# EasyEDA Pro project ProPrj_小中心板_2025-08-09.epro, board PCB2
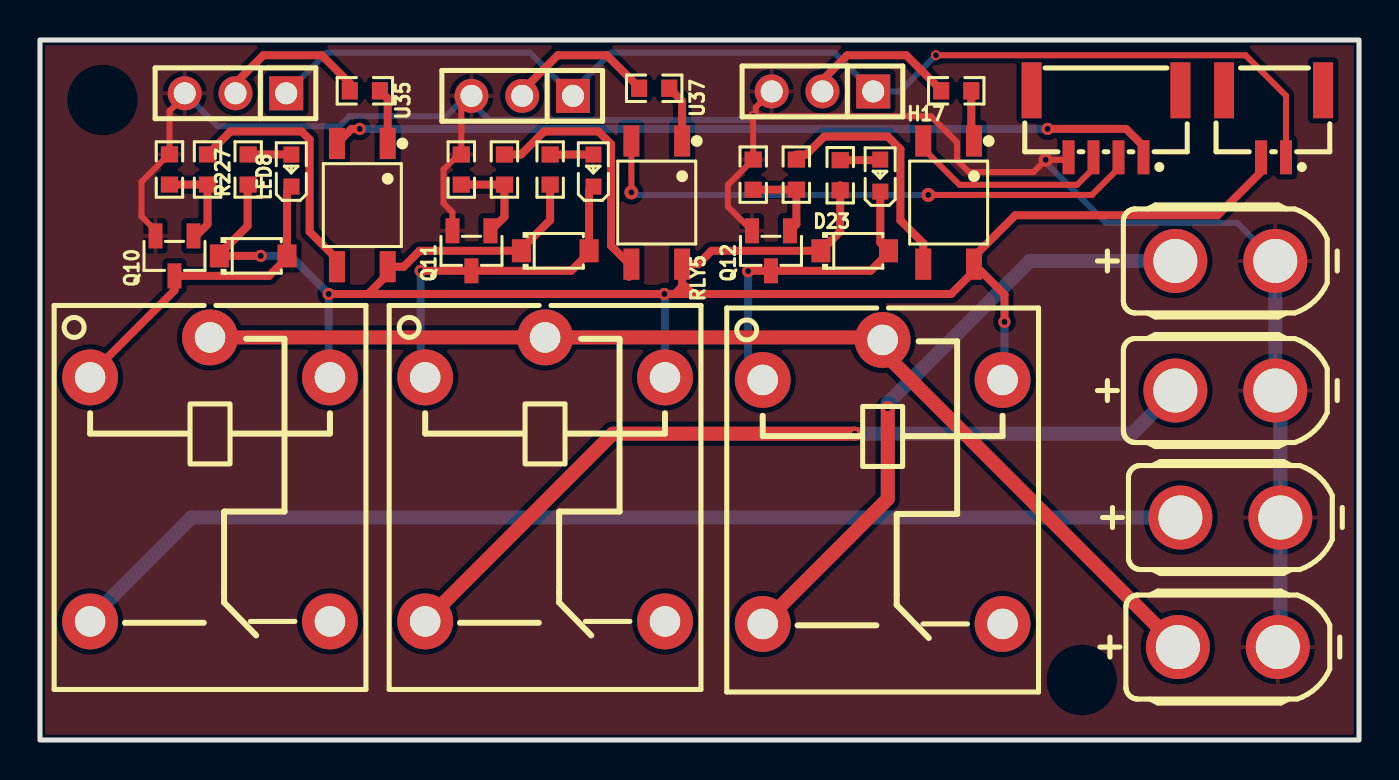
[diagram p6: board, top side]
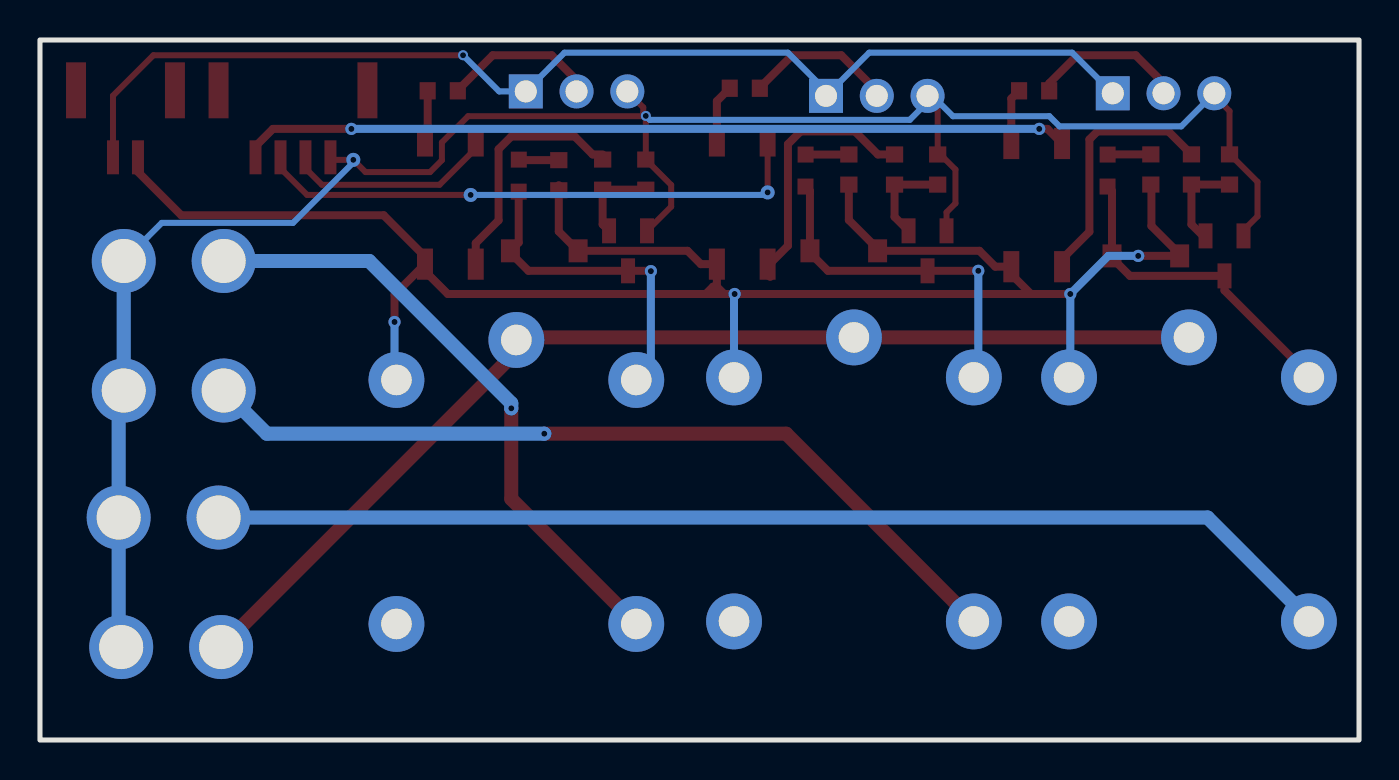
[diagram p7: board, bottom side, seen from below]

Outline 66 x 35 mm; copper layers: Top Layer, Bottom Layer. Coordinates in mm from the lower left corner of the outline.
Outline path: rectangle 0,35 66,0
Stack: Top Layer 0.035mm / Dielectric1 1.51mm FR4 er 4.5 / Bottom Layer 0.035mm

## Design rules (mm)
template: JLCPCB Capability(Two Layers Board)
spacing copperThickness1oz (default): track to track 0.102, other pairs 0.152 to 0.3
spacing copperThickness2oz: track to track 0.203, other pairs 0.152 to 0.3
track width copperThickness1oz (default): min 0.127, default 0.254, max 2.54
track width copperThickness2oz: min 0.203, default 0.254, max 2.54
differential pair differentialPair (default): width min 0.127, default 0.254, max 2.54; gap min 0.152, default 0.152
via viaSize (default): diameter min 0.5, default 0.61, max 10; hole min 0.3, default 0.305, max 6.3

## Placement (name value [footprint] x y rotation side)
CN22  WAFER-GH1.25-2PLB  [CONN-TH_2P-P1.25_XUNPU_WAFER-GH1.25-2PLB]  61.72 30.81 180 top
D22  1N4148W  [SOD-123_L2.8-W1.8-LS3.7-RD-1]  25.78 24.46 0 top
D23  1N4148W  [SOD-123_L2.8-W1.8-LS3.7-RD-1]  40.77 24.46 0 top
D24  1N4148W  [SOD-123_L2.8-W1.8-LS3.7-RD-1]  10.67 24.2 0 top
H15  PZ254V-11-03P  [HDR-TH_3P-P2.54-V-M]  9.78 32.34 180 top
H16  PZ254V-11-03P  [HDR-TH_3P-P2.54-V-M]  24.13 32.21 180 top
H17  PZ254V-11-03P  [HDR-TH_3P-P2.54-V-M]  39.15 32.43 180 top
J1  XT30UPB-F30.G.Y  [CONN-TH_XT30UPB-F]  59.56 11.12 0 top
J2  XT30UPB-F30.G.Y  [CONN-TH_XT30UPB-F]  59.31 17.47 0 top
J3  XT30UPB-F30.G.Y  [CONN-TH_XT30UPB-F]  59.31 23.95 0 top
J4  XT30UPB-F30.G.Y  [CONN-TH_XT30UPB-F]  59.44 4.65 0 top
LED8  -  [LED_0603]  12.57 28.52 90 top
LED9  -  [LED_0603]  27.69 28.52 90 top
LED10  -  [LED_0603]  42.04 28.27 90 top
Q10  S8050  [SOT-23-3_L2.9-W1.3-P1.90-LS2.4-BR]  6.73 24.2 90 top
Q11  S8050  [SOT-23-3_L2.9-W1.3-P1.90-LS2.4-BR]  21.59 24.46 90 top
Q12  S8050  [SOT-23-3_L2.9-W1.3-P1.90-LS2.4-BR]  36.58 24.46 90 top
R217  4.7K  [R0603]  23.24 28.52 90 top
R218  10K  [R0603]  21.08 28.52 90 top
R219  1K  [R0603]  25.53 28.52 90 top
R220  470Ω  [R0603]  45.85 32.46 180 top
R221  4.7K  [R0603]  37.85 28.27 90 top
R222  10K  [R0603]  35.69 28.27 90 top
R223  1K  [R0603]  40.04 28.24 90 top
R224  470Ω  [R0603]  16.26 32.46 180 top
R225  4.7K  [R0603]  8.39 28.53 90 top
R226  10K  [R0603]  6.48 28.53 90 top
R227  1K  [R0603]  10.42 28.53 90 top
R228  470Ω  [R0603]  30.73 32.59 180 top
RLY4  SRD-05VDC-SL-C  [RELAY-TH_SRD-XXVDC-XL-C]  8.51 13.03 270 top
RLY5  SRD-05VDC-SL-C  [RELAY-TH_SRD-XXVDC-XL-C]  25.27 13.03 270 top
RLY6  SRD-05VDC-SL-C  [RELAY-TH_SRD-XXVDC-XL-C]  42.16 12.9 270 top
U10  WAFER-GH1.25-4PLB  [CONN-SMD_4P-P1.25_XUNPU_WAFER-GH1.25-4PLB]  53.34 30.81 180 top
U35  LTV-354T-A  [SOP-4_L3.9-W4.4-P2.54-LS7.0-TL]  16.13 26.75 270 top
U37  LTV-354T-A  [SOP-4_L3.9-W4.4-P2.54-LS7.0-TL]  30.86 26.87 270 top
U39  LTV-354T-A  [SOP-4_L3.9-W4.4-P2.54-LS7.0-TL]  45.47 26.87 270 top

## Footprints (pads in the part's own frame, mm; a bottom-side part is the same pattern mirrored in y, then rotated)
CONN-SMD_4P-P1.25_XUNPU_WAFER-GH1.25-4PLB
  rect 0.6x1.7 smd: 1(-1.875,1.675) 2(-0.625,1.675) 3(0.625,1.675) 4(1.875,1.675)
  rect 1x2.8 smd: 5(-3.725,-1.675) 6(3.725,-1.675)
CONN-TH_2P-P1.25_XUNPU_WAFER-GH1.25-2PLB
  rect 0.6x1.7 smd: 1(-0.625,1.675) 2(0.625,1.675)
  rect 1x2.8 smd: 3(2.475,-1.675) 4(-2.475,-1.675)
CONN-TH_XT30UPB-F
  round 3.2 hole 2.2: 1(-2.5,0) 2(2.5,0)
HDR-TH_3P-P2.54-V-M
  rect 1.7x1.7 hole 1.1: 1(-2.54,0)
  round 1.7 hole 1.1: 2(0,0) 3(2.54,0)
LED_0603
  rect 0.8x0.8 smd: 1(-0.851,-0.01) 2(0.75,-0.005)
R0603
  rect 0.806x0.864 smd: 1(-0.753,0) 2(0.753,0)
RELAY-TH_SRD-XXVDC-XL-C
  round 2.794 hole 1.524: 1(-5.1,-6) 2(7.1,-6) 3(7.1,6) 4(-5.1,6) 5(-7.1,0)
SOD-123_L2.8-W1.8-LS3.7-RD-1
  rect 0.95x1.15 smd: 1(-1.692,0) 2(1.692,0)
SOP-4_L3.9-W4.4-P2.54-LS7.0-TL
  rect 1.56x0.8 smd: 1(-3.08,1.27) 2(-3.08,-1.27) 3(3.08,-1.27) 4(3.08,1.27)
SOT-23-3_L2.9-W1.3-P1.90-LS2.4-BR
  rect 1.25x0.7 smd: 1(1,-0.95) 2(1,0.95) 3(-1,0)

## Nets
As in the schematic.

Pads without a net: CN22 3 4; U10 5 6

## Via types
v1: diameter 0.61, hole 0.305, Top Layer to Bottom Layer, 9 vias
v2: diameter 0.7, hole 0.3, Top Layer to Bottom Layer, 5 vias
v3: diameter 0.5, hole 0.3, Top Layer to Bottom Layer, 2 vias

## Routing (per net, layer and track width the routed paths; a pad name or vN(x,y) marks a point on that pad's centre or on a via; arc(x,y) is an arc through that point)
PGND: length 105.9
  Top Layer w0.3: v3(35.69,31.2) 35.7,31.19 44.58,31.19 45.89,29.88 45.89,28.99 46.48,28.4 49.71,28.4 v2(50.32,29.01) 51.34,29.01 U10.4 ; v3(35.69,31.2) 35.81,31.33 35.81,31.63 H17.3 ; v3(35.69,31.2) R222.2 34.42,27.75 34.42,26.67 Q12.2 ; 21.46,32.33 21.08,31.95 R218.2 20.95,29.28 20.19,28.52 20.19,26.83 20.64,26.38 Q11.2 ; Q10.2 5.78,25.48 5.08,26.18 5.08,27.91 6.45,29.28 R226.2 6.48,31.45 7.5,32.46
  Bottom Layer w0.3: v2(50.32,29.01) 50.32,28.87 53.34,25.86 59.9,25.86 J3.2 ; 21.46,32.33 20.32,31.19 15.49,31.19 14.99,30.68 8.9,30.68 H15.3 ; v3(35.69,31.2) 35.49,31.01 22.48,31.01 21.59,31.9 H16.3
  Bottom Layer w0.7: J3.2 J2.2 62.06,17.22 J1.2 62.06,4.77 J4.2
VCC_3V3: length 58
  Top Layer w0.3: CN22.1 62.35,32.22 60.33,34.24 v3(44.83,34.24)
  Bottom Layer w0.3: H15.1 14.35,34.36 24.51,34.36 26.54,32.33 28.58,34.36 39.76,34.36 H17.1 43.02,32.43 v3(44.83,34.24)
VCC_5V: length 101.9
  Top Layer w0.4: 32.13,22.67 32.32,22.67 32.69,22.3 ; 32.13,22.67 31.76,22.3 ; 32.13,22.67 32.13,22.43 32,22.3 ; 32.13,22.67 U37.4 32.93,23.79 33.6,24.46 D23.1 40.04,25.43 40.04,27.74 ; 32.69,22.3 32,22.3 ; 32.69,22.3 45.59,22.3 46.74,23.44 U39.4 ; 16.41,22.3 17.4,23.28 U35.4 18.2,23.67 18.99,24.46 D22.1 24.09,24.56 25.53,26 R219.1 ; 16.41,22.3 v1(14.45,22.3) ; 16.41,22.3 v1(31.24,22.3) 31.76,22.3 ; U39.4 48.26,22.27 v1(48.26,20.9) ; U39.4 46.74,24.17 48.8,26.24 58.93,26.24 61.18,28.49 61.18,29.05 CN22.2 ; R227.1 10.39,27.77 10.39,25.7 8.98,24.29 D24.1 v1(11.05,24.2) ; 31.76,22.3 32,22.3
  Bottom Layer w0.4: v1(11.05,24.2) 12.54,24.2 v1(14.45,22.3) 14.45,18.19 14.38,18.13 ; v1(48.26,20.9) 48.26,18.22 48.16,18.13 ; RLY5.4 31.27,22.27 v1(31.24,22.3)
VCC_BAT: length 55.4
  Top Layer w0.7: 8.38,20.13 RLY5.5 42.16,20.13 42.16,19.42 J4.1
CH1: length 41.6
  Top Layer w0.4: U35.2 15.59,30.56 v1(16,30.56) ; U10.1 55.21,29.68 54.34,30.56 v1(50.42,30.56)
  Bottom Layer w0.4: v1(16,30.56) v1(50.42,30.56)
CH2: length 28.1
  Top Layer w0.3: v2(29.59,27.38) U37.2 ; U10.2 53.96,28.58 52.63,27.25 v2(44.45,27.25)
  Bottom Layer w0.3: v2(44.45,27.25) 29.72,27.25 v2(29.59,27.38)
CH3: length 10.5
  Top Layer w0.3: U10.3 52.71,28.58 51.89,27.76 46.01,27.76 44.2,29.57 U39.2
NO1: length 56.8
  Bottom Layer w0.7: J1.1 7.58,11.12 2.38,5.93
NO2: length 42.3
  Top Layer w0.7: v1(19.27,5.93) 28.66,15.31 v2(40.77,15.31)
  Bottom Layer w0.7: v2(40.77,15.31) 54.65,15.31 J2.1
NO3: length 31
  Top Layer w0.7: v2(42.42,16.58) 42.42,12.06 RLY6.2
  Bottom Layer w0.7: v2(42.42,16.58) 42.42,16.84 49.53,23.95 J3.1
$1N1348: length 12.7
  Top Layer w0.4: R225.2 9.53,30.43 13.09,30.43 13.49,30.03 13.49,25.41 14.86,24.05 U35.3
$1N1351: length 2.8
  Top Layer w0.4: R224.1 17.4,32.07 U35.1
$1N1352: length 4.7
  Top Layer w0.4: R226.1 R225.1 8.39,25.78 7.81,25.2
$1N1355: length 16.5
  Top Layer w0.4: LED8.1 12.36,27.45 D24.2 12.36,24.11 11.46,23.2 Q10.3 6.73,22.48 2.38,18.13
$1N1356: length 2.2
  Top Layer w0.4: R227.2 12.57,29.28 LED8.2
$1N1359: length 7.8
  Top Layer w0.4: R224.2 15.5,32.83 14.1,34.24 11.18,34.24 9.78,32.84 H15.2
$1N1374: length 13.1
  Top Layer w0.4: 29.46,23.16 29.46,23.82 28.58,24.71 28.58,29.79 27.94,30.43 25.22,30.43 24.07,29.28 R217.2
$1N1377: length 2.9
  Top Layer w0.4: R228.1 32.13,31.94 U37.1
$1N1378: length 4.8
  Top Layer w0.4: R218.1 R217.1 23.24,26.16 Q11.1
$1N1381: length 17.6
  Top Layer w0.4: v1(19.05,23.46) Q11.3 26.57,23.46 27.47,24.36 D22.2 27.47,27.45 LED9.1
  Bottom Layer w0.4: RLY5.1 19.05,18.35 v1(19.05,23.46)
$1N1382: length 2.2
  Top Layer w0.4: LED9.2 25.53,29.27 R219.2
$1N1385: length 7.5
  Top Layer w0.4: 24,32.33 25.91,34.24 28.36,34.24 29.98,32.62 R228.2
$1N1400: length 12.1
  Top Layer w0.4: 37.85,29.28 38.35,29.28 39.24,30.17 42.42,30.17 43.05,29.54 43.05,25.98 44.2,24.84 U39.3
$1N1403: length 2.6
  Top Layer w0.4: R220.1 46.6,30.09 U39.1
$1N1404: length 4.3
  Top Layer w0.4: R222.1 R221.1 37.85,25.78 Q12.1
$1N1407: length 16.3
  Top Layer w0.4: LED10.1 42.05,24.87 D23.2 42.46,24.36 41.56,23.46 Q12.3 35.45,23.46 v1(35.43,23.44)
  Bottom Layer w0.4: v1(35.43,23.44) 35.43,18.86 36.16,18.13
$1N1408: length 2
  Top Layer w0.4: R223.2 42.02,28.99 LED10.2
$1N1411: length 7.8
  Top Layer w0.4: H17.2 39.15,33 40.39,34.24 43.34,34.24 45.09,32.49 R220.2

## Copper pours and planes (outline as drawn; the poured copper is in the pictures)
PGND on Top Layer: -5.33,37.41 68.58,37.41 68.58,-3.86 -5.33,-3.86
